# Altium schematic sheet Test points.SchDoc: Eval Board -  Test points
size A3; Author: O. Guinnard; Organization: imperix Ltd; Address1: Rue de l'Industrie 10; Address2: 1950 Sion; Address3: Switzerland; Address4: +41 27 552 06 60; DocumentNumber: 6; SheetNumber: 6; SheetTotal: 7
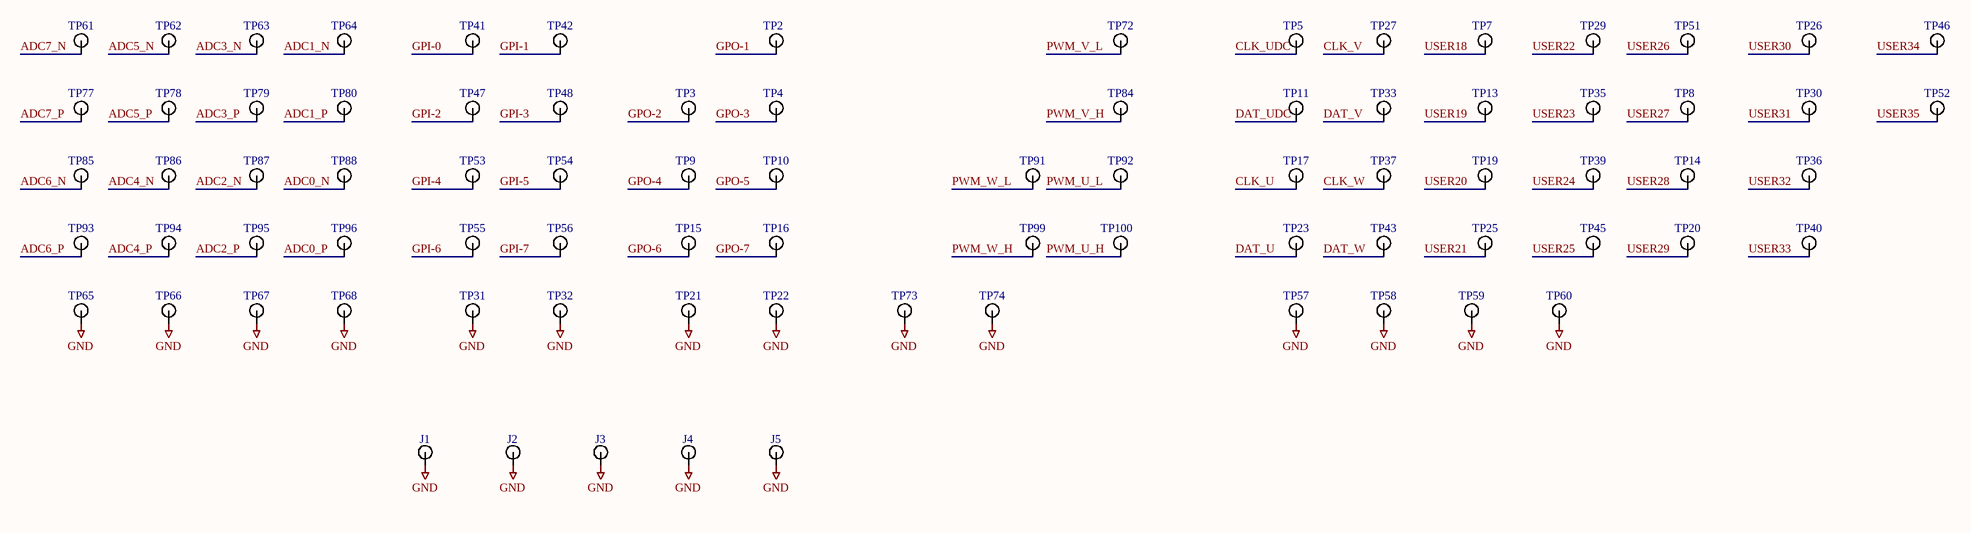
[diagram p0: Test points.SchDoc]

## Parts
J1  1625854-1  [TP-3216L(1206)]  (value not drawn)
J2  1625854-1  [TP-3216L(1206)]  (value not drawn)
J3  1625854-1  [TP-3216L(1206)]  (value not drawn)
J4  1625854-1  [TP-3216L(1206)]  (value not drawn)
J5  1625854-1  [TP-3216L(1206)]  (value not drawn)
TP2  5001  [5001]  (value not drawn)
TP3  5001  [5001]  (value not drawn)
TP4  5001  [5001]  (value not drawn)
TP5  5001  [5001]  (value not drawn)
TP7  5001  [5001]  (value not drawn)
TP8  5001  [5001]  (value not drawn)
TP9  5001  [5001]  (value not drawn)
TP10  5001  [5001]  (value not drawn)
TP11  5001  [5001]  (value not drawn)
TP13  5001  [5001]  (value not drawn)
TP14  5001  [5001]  (value not drawn)
TP15  5001  [5001]  (value not drawn)
TP16  5001  [5001]  (value not drawn)
TP17  5001  [5001]  (value not drawn)
TP19  5001  [5001]  (value not drawn)
TP20  5001  [5001]  (value not drawn)
TP21  5001  [5001]  (value not drawn)
TP22  5001  [5001]  (value not drawn)
TP23  5001  [5001]  (value not drawn)
TP25  5001  [5001]  (value not drawn)
TP26  5001  [5001]  (value not drawn)
TP27  5001  [5001]  (value not drawn)
TP29  5001  [5001]  (value not drawn)
TP30  5001  [5001]  (value not drawn)
TP31  5001  [5001]  (value not drawn)
TP32  5001  [5001]  (value not drawn)
TP33  5001  [5001]  (value not drawn)
TP35  5001  [5001]  (value not drawn)
TP36  5001  [5001]  (value not drawn)
TP37  5001  [5001]  (value not drawn)
TP39  5001  [5001]  (value not drawn)
TP40  5001  [5001]  (value not drawn)
TP41  5001  [5001]  (value not drawn)
TP42  5001  [5001]  (value not drawn)
TP43  5001  [5001]  (value not drawn)
TP45  5001  [5001]  (value not drawn)
TP46  5001  [5001]  (value not drawn)
TP47  5001  [5001]  (value not drawn)
TP48  5001  [5001]  (value not drawn)
TP51  5001  [5001]  (value not drawn)
TP52  5001  [5001]  (value not drawn)
TP53  5001  [5001]  (value not drawn)
TP54  5001  [5001]  (value not drawn)
TP55  5001  [5001]  (value not drawn)
TP56  5001  [5001]  (value not drawn)
TP57  5001  [5001]  (value not drawn)
TP58  5001  [5001]  (value not drawn)
TP59  5001  [5001]  (value not drawn)
TP60  5001  [5001]  (value not drawn)
TP61  5001  [5001]  (value not drawn)
TP62  5001  [5001]  (value not drawn)
TP63  5001  [5001]  (value not drawn)
TP64  5001  [5001]  (value not drawn)
TP65  5001  [5001]  (value not drawn)
TP66  5001  [5001]  (value not drawn)
TP67  5001  [5001]  (value not drawn)
TP68  5001  [5001]  (value not drawn)
TP72  5001  [5001]  (value not drawn)
TP73  5001  [5001]  (value not drawn)
TP74  5001  [5001]  (value not drawn)
TP77  5001  [5001]  (value not drawn)
TP78  5001  [5001]  (value not drawn)
TP79  5001  [5001]  (value not drawn)
TP80  5001  [5001]  (value not drawn)
TP84  5001  [5001]  (value not drawn)
TP85  5001  [5001]  (value not drawn)
TP86  5001  [5001]  (value not drawn)
TP87  5001  [5001]  (value not drawn)
TP88  5001  [5001]  (value not drawn)
TP91  5001  [5001]  (value not drawn)
TP92  5001  [5001]  (value not drawn)
TP93  5001  [5001]  (value not drawn)
TP94  5001  [5001]  (value not drawn)
TP95  5001  [5001]  (value not drawn)
TP96  5001  [5001]  (value not drawn)
TP99  5001  [5001]  (value not drawn)
TP100  5001  [5001]  (value not drawn)

## Nets
GND: J1.1(TP) J2.1(TP) J3.1(TP) J4.1(TP) J5.1(TP) TP21.1(TP) TP22.1(TP) TP31.1(TP) TP32.1(TP) TP57.1(TP) TP58.1(TP) TP59.1(TP) TP60.1(TP) TP65.1(TP) TP66.1(TP) TP67.1(TP) TP68.1(TP) TP73.1(TP) TP74.1(TP)
ADC0_N: TP88.1(TP)
ADC0_P: TP96.1(TP)
ADC1_N: TP64.1(TP)
ADC1_P: TP80.1(TP)
ADC2_N: TP87.1(TP)
ADC2_P: TP95.1(TP)
ADC3_N: TP63.1(TP)
ADC3_P: TP79.1(TP)
ADC4_N: TP86.1(TP)
ADC4_P: TP94.1(TP)
ADC5_N: TP62.1(TP)
ADC5_P: TP78.1(TP)
ADC6_N: TP85.1(TP)
ADC6_P: TP93.1(TP)
ADC7_N: TP61.1(TP)
ADC7_P: TP77.1(TP)
CLK_U: TP17.1(TP)
CLK_UDC: TP5.1(TP)
CLK_V: TP27.1(TP)
CLK_W: TP37.1(TP)
DAT_U: TP23.1(TP)
DAT_UDC: TP11.1(TP)
DAT_V: TP33.1(TP)
DAT_W: TP43.1(TP)
GPI-0: TP41.1(TP)
GPI-1: TP42.1(TP)
GPI-2: TP47.1(TP)
GPI-3: TP48.1(TP)
GPI-4: TP53.1(TP)
GPI-5: TP54.1(TP)
GPI-6: TP55.1(TP)
GPI-7: TP56.1(TP)
GPO-1: TP2.1(TP)
GPO-2: TP3.1(TP)
GPO-3: TP4.1(TP)
GPO-4: TP9.1(TP)
GPO-5: TP10.1(TP)
GPO-6: TP15.1(TP)
GPO-7: TP16.1(TP)
PWM_U_H: TP100.1(TP)
PWM_U_L: TP92.1(TP)
PWM_V_H: TP84.1(TP)
PWM_V_L: TP72.1(TP)
PWM_W_H: TP99.1(TP)
PWM_W_L: TP91.1(TP)
USER18: TP7.1(TP)
USER19: TP13.1(TP)
USER20: TP19.1(TP)
USER21: TP25.1(TP)
USER22: TP29.1(TP)
USER23: TP35.1(TP)
USER24: TP39.1(TP)
USER25: TP45.1(TP)
USER26: TP51.1(TP)
USER27: TP8.1(TP)
USER28: TP14.1(TP)
USER29: TP20.1(TP)
USER30: TP26.1(TP)
USER31: TP30.1(TP)
USER32: TP36.1(TP)
USER33: TP40.1(TP)
USER34: TP46.1(TP)
USER35: TP52.1(TP)

## Notes on the sheet
- Title:
- Imperix Ltd
- Route des Ronquos 23
- Author:
- Project:
- Size:
- A3
- Date:
- Time:
- Revision:
- Sheet
- of
- 1950 Sion
- Switzerland
- +41 27 552 06 60
- dev@imperix.ch
- Revised by:
- File:

## Library data of the parts
J1-J5 = CMP-018-000000-12: Natural PC Test Point Plating Surface Mount Mounting Type; Color: Natural; Packaging: Tape and Reel; Package Quantity: 2000; Max Operating Temperature: 125°C; Series: RC, CGS; Radiation Hardening: No; RoHS Compliant: Yes; Min Operating Temperature: -55°C; Case/Package: 1206; Mounting Technology: Surface Mount
TP2-TP5 TP7-TP11 TP13-TP17 TP19-TP23 TP25-TP27 TP29-TP33 TP35-TP37 TP39-TP43 TP45-TP48 TP51-TP68 TP72-TP74 TP77-TP80 TP84-TP88 TP91-TP96 TP99 TP100 = CMP-049-000000-14: Black PC Test Point, Miniature Phosphor Bronze Silver Plating Through Hole Mounting Type; Hole Diameter: 1.6mm; Inside Diameter: 1.27mm; Outside Diameter: 2.54mm; Number of Contacts: 1; Insulation: Insulated; Body Material: Bronze; Color: Black; Contact Material: Bronze; Contact Plating: Tin,Silver; Lead Free: Lead Free; Length: 7.62mm; Material: Nylon,Bronze,Silver; Mounting Technology: Through Hole; Package Quantity: 100; Packaging: Bulk; Reach SVHC Compliant: No; RoHS Compliant: Yes; Series: THM; Insulation Material: Nylon; Housing Color: Black; Orientation: Straight; Diameter: 2.54mm; Termination: Through Hole; Number of Ports: 1; Plating: Silver